# EAGLE design glove-snap (EAGLE 9.6.2)
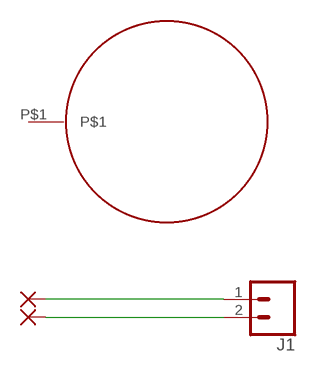
[diagram p0: schematic, sheet 1]

## Parts
J1  CONN_02LOCK_LONGPADS  [1X02_LOCK_LONGPADS]
PAD1  WIREPADSMD2,54-5,08  [SMD2,54-5,08]
PAD2  WIREPADSMD2,54-5,08  [SMD2,54-5,08]
U$1  SNAP  [SNAP]

## Nets
N$1: J1.1 PAD1.1(P)
N$2: J1.2 PAD2.1(P)
Unconnected: U$1.P$1

## Library data of the parts
J1 = SparkFun-Connectors:CONN_02: Multi connection point. Often used as Generic Header-pin footprint for 0.1 inch spaced/style header connections On any of the 0.1 inch spaced packages, you can populate with these: Break Away Headers - Straight <https://www.sparkfun.com/products/116> (PRT-00116) Break Away Male Headers - Right Angle <https://www.sparkfun.com/products/553> (PRT-00553) Female Headers <https://www.sparkfun.com/products/115> (PRT-00115) Break Away Headers - Machine Pin <https://www.sparkfun.com/products/117> (PRT-00117) Break Away Female Headers - Swiss Machine Pin <https://www.sparkfun.com/products/743> (PRT-00743) For SCREWTERMINALS and SPRING TERMINALS visit here: Screw Terimnals on SparkFun.com <https://www.sparkfun.com/search/results?term=Screw+Terminals> (5mm/3.5mm/2.54mm spacing) This device is also useful as a general connection point to wire up your design to another part of your project. Our various solder wires solder well into these plated through hole pads. Hook-Up Wire - Assortment (Stranded, 22 AWG) <https://www.sparkfun.com/products/11375> (PRT-11375) Hook-Up Wire - Assortment (Solid Core, 22 AWG) <https://www.sparkfun.com/products/11367> (PRT-11367) View the entire wire category on our website here <https://www.sparkfun.com/categories/141> Special notes: Molex polarized connector foot print use with: PRT-08233 with associated crimp pins and housings. 2.54_SCREWTERM for use with PRT-10571. 3.5mm Screw Terminal footprints for PRT-08084 5mm Screw Terminal footprints for use with PRT-08432
PAD1 PAD2 = wirepad:WIREPAD: Wire PAD connect wire on PCB
U$1 = snap:SNAP

## Board
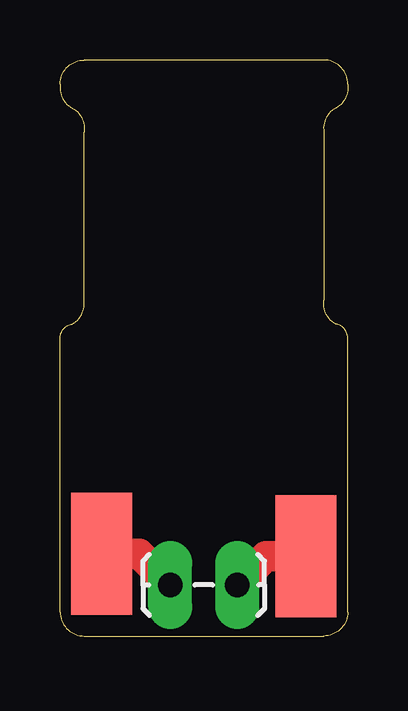
[diagram p1: board, top side]
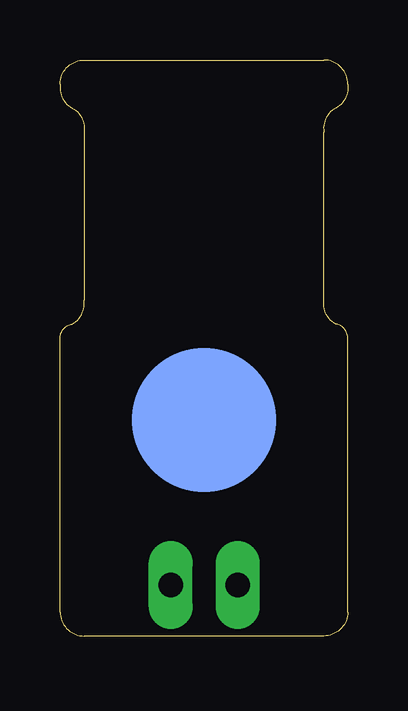
[diagram p2: board, bottom side, seen from below]

Size 12.02 x 24 mm. Coordinates in mm from the lower left corner, seen from the top.
Outline: 1.01,14 1.01,21 arc70 0.51,22 arc-70 0.01,23 arc-90 1.01,24 11.01,24 arc-90 12.01,23 arc-70 11.51,22 arc70 11.01,21 11.01,14 arc70 11.51,13 arc-70 12.01,12.5 12.01,1 arc-90 11.01,0 1.01,0 arc-90 0.01,1 0.01,12.5 arc-70 0.51,13 arc70 1.01,14
Copper layers (1*16): Top 0.035mm / dielectric 1.6mm / Bottom 0.035mm
Design rules "jlcpcb-2layers": minimum track width 5mil, minimum drill 0.3mm, track to track 5mil, track to pad 5mil, pad to pad 5mil, via to via 5mil, smd to smd 5mil, copper to edge 0.2mm, drill to drill 6mil, minimum pad ring 10mil, minimum via ring 3mil, stop-mask expansion 4mil, vias tented up to drill 0mil, thermal gap 10mil

### Footprints (pad centres in the part's own frame; a part is rotated, then mirrored left to right if it is on the bottom)
1X02_LOCK_LONGPADS = drill 1.016 long: 1 -0.127,0; 2 2.667,0
SMD2,54-5,08 = smd 2.54 x 5.08: 1 0,0
SNAP = smd 6 x 6: P$1 0,0

### Placement (x,y rotation side)
J1  4.73,2.13 0 top
PAD1  1.74,3.43 0 top
PAD2  10.26,3.33 0 top
U$1  6.01,9 0 bottom

### Tracks (layer width: path | path; a pad name or v marks a point on that pad's centre or on a via)
N$1
  Top 1.27: J1.1 3.3,3.43 PAD1.1
N$2
  Top 1.27: J1.2 8.6,3.33 PAD2.1